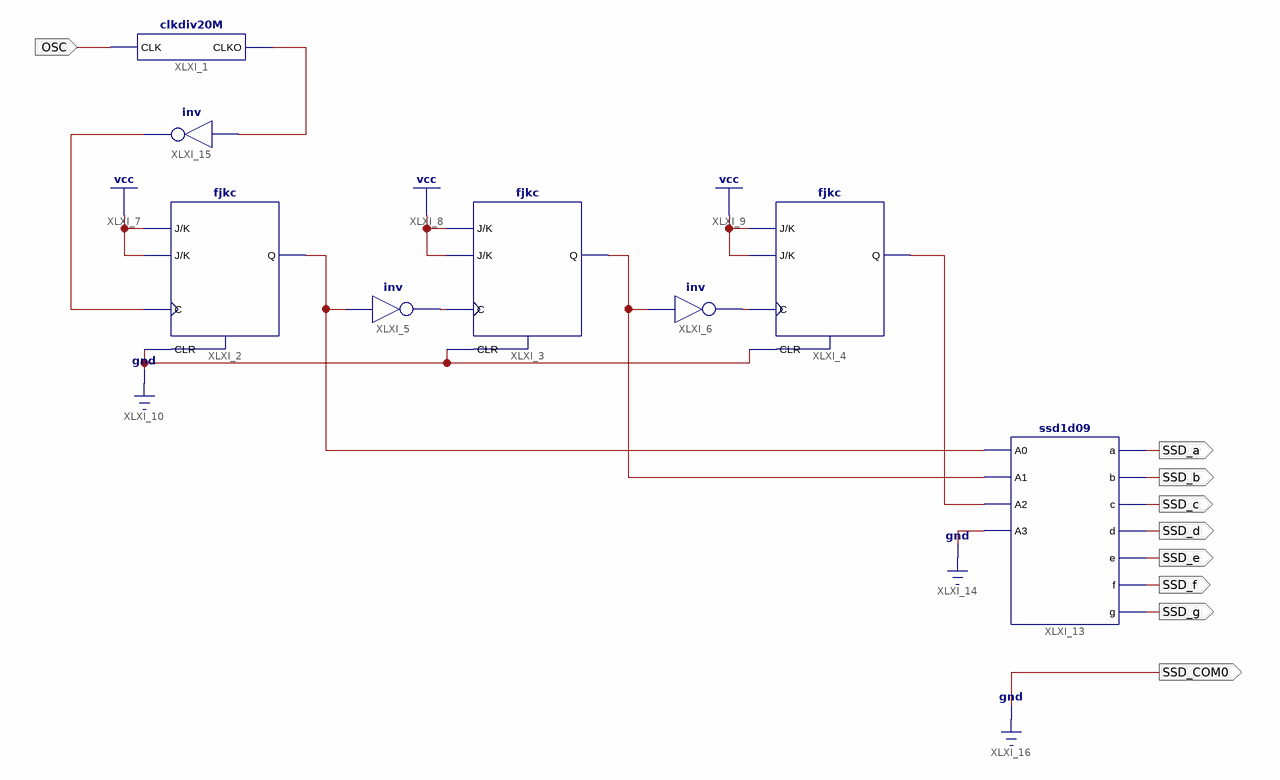
[diagram p0: schematic sheet 1]
// Xilinx ISE schematic main.sch (spartan6) as structural Verilog: 8 symbols, 9 ports
module main (
  input  OSC,
  output SSD_a,
  output SSD_b,
  output SSD_c,
  output SSD_d,
  output SSD_e,
  output SSD_f,
  output SSD_g,
  output SSD_COM0
);

  wire XLXN_2, XLXN_3, XLXN_4, XLXN_5, XLXN_6, XLXN_20, XLXN_22;

  clkdiv20M XLXI_1 (.CLK(OSC), .CLKO(XLXN_22));
  fjkc XLXI_2 (.C(XLXN_6), .CLR(1'b0), .J(1'b1), .K(1'b1), .Q(XLXN_2));
  fjkc XLXI_3 (.C(XLXN_4), .CLR(1'b0), .J(1'b1), .K(1'b1), .Q(XLXN_3));
  fjkc XLXI_4 (.C(XLXN_5), .CLR(1'b0), .J(1'b1), .K(1'b1), .Q(XLXN_20));
  not XLXI_5 (XLXN_4, XLXN_2);
  not XLXI_6 (XLXN_5, XLXN_3);
  ssd1d09 XLXI_13 (
    .a(SSD_a), .A0(XLXN_2), .A1(XLXN_3), .A2(XLXN_20), .A3(1'b0), .b(SSD_b), .c(SSD_c), .d(SSD_d), .e(SSD_e),
    .f(SSD_f), .g(SSD_g));
  not XLXI_15 (XLXN_6, XLXN_22);

  assign SSD_COM0 = 1'b0;
endmodule
